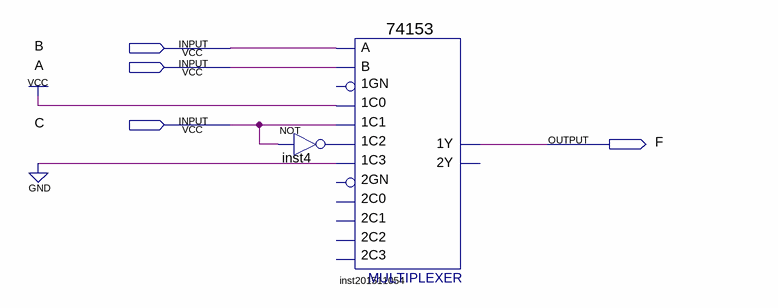
[diagram p0: schematic sheet]
// Quartus schematic lab04_2_2.bdf as structural Verilog: 2 symbols, 4 pins
module lab04_2_2 (
  input  B,
  input  A,
  input  C,
  output F
);

  wire inst4_out;

  not inst4 (inst4_out, C);
  \74153  inst201511054 (
    .\1C1 (C), .\1C0 (1'b1), .\1C2 (inst4_out), .\1C3 (1'b0), .B(A), .A(B), .\1Y (F));  // open: 1GN, 2C0, 2GN, 2C2, 2C1, 2C3, 2Y
endmodule
